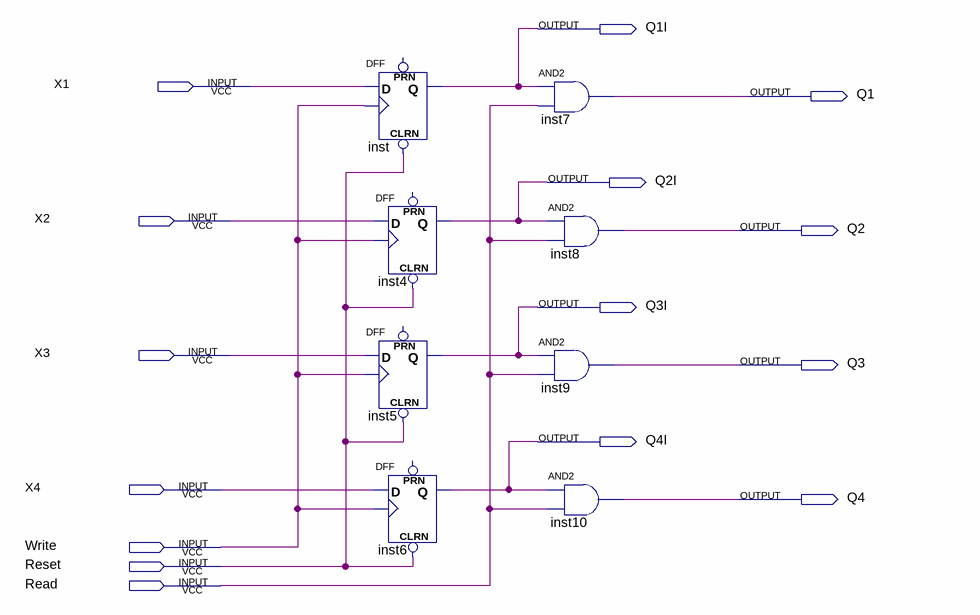
[diagram p0: schematic sheet]
// Quartus schematic Simplest_memory_regi.bdf as structural Verilog: 8 symbols, 15 pins
module Simplest_memory_regi (
  input  X1,
  input  X2,
  input  X3,
  input  X4,
  input  Write,
  input  Reset,
  input  Read,
  output Q1I,
  output Q1,
  output Q2I,
  output Q2,
  output Q3I,
  output Q3,
  output Q4I,
  output Q4
);

  DFF inst (.CLRN(Reset), .CLK(Write), .D(X1), .Q(Q1I));  // open: PRN
  DFF inst5 (.CLRN(Reset), .CLK(Write), .D(X3), .Q(Q3I));  // open: PRN
  DFF inst4 (.CLRN(Reset), .CLK(Write), .D(X2), .Q(Q2I));  // open: PRN
  DFF inst6 (.CLRN(Reset), .CLK(Write), .D(X4), .Q(Q4I));  // open: PRN
  and inst7 (Q1, Q1I, Read);
  and inst8 (Q2, Q2I, Read);
  and inst9 (Q3, Q3I, Read);
  and inst10 (Q4, Q4I, Read);
endmodule
